# EAGLE design avrisp (EAGLE 4.16)
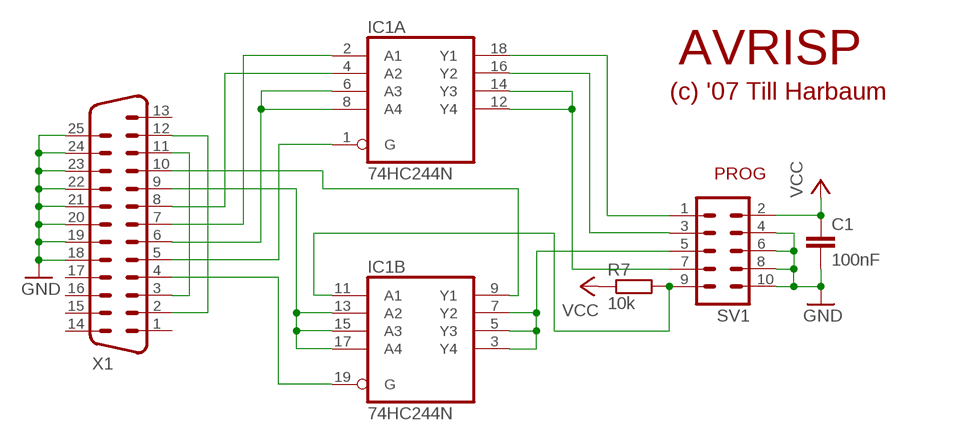
[diagram p0: schematic, sheet 1]

## Parts
C1  100nF  C-EU050-025X075  [C050-025X075]
IC1  74HC244N  [DIL20]
R7  10k  R-EU_0207/10  [0207/10]
SV1  ML10  [ML10]
X1  M25D  [M25D]

## Nets
GND: C1.2 SV1.4 SV1.6 SV1.8 SV1.10 X1.18 X1.19 X1.20 X1.21 X1.22 X1.23 X1.24 X1.25
N$1: IC1.16(A:Y2) SV1.3
N$4: IC1.3(B:Y4) IC1.5(B:Y3) IC1.7(B:Y2) SV1.5
N$5: IC1.9(B:Y1) X1.10
N$8: IC1.1(A:G) X1.5
N$9: IC1.13(B:A2) IC1.15(B:A3) IC1.17(B:A4) X1.9
N$10: X1.2 X1.12
N$11: X1.3 X1.11
N$13: IC1.4(A:A2) X1.8
N$14: IC1.18(A:Y1) SV1.1
N$15: IC1.12(A:Y4) IC1.14(A:Y3) SV1.7
N$16: IC1.11(B:A1) R7.2 SV1.9
N$17: IC1.2(A:A1) X1.7
N$18: IC1.6(A:A3) IC1.8(A:A4) X1.6
N$19: IC1.19(B:G) X1.4
VCC: C1.1 R7.1 SV1.2
Unconnected: X1.1 X1.13 X1.14 X1.15 X1.16 X1.17

## Notes on the sheet
- AVRISP
- (c) '07 Till Harbaum
- PROG

## Power pins joined to a net without a drawn wire
GND: IC1.10(P:GND)
VCC: IC1.20(P:VCC)

## Library data of the parts
C1 = rcl:C-EU: CAPACITOR, European symbol
IC1 = 74xx-eu:74*244: Octal BUFFER and LINE DRIVER, 3-state
R7 = rcl:R-EU_: RESISTOR, European symbol
SV1 = con-ml:ML10: HARTING
X1 = con-subd:M25: SUB-D

## Board
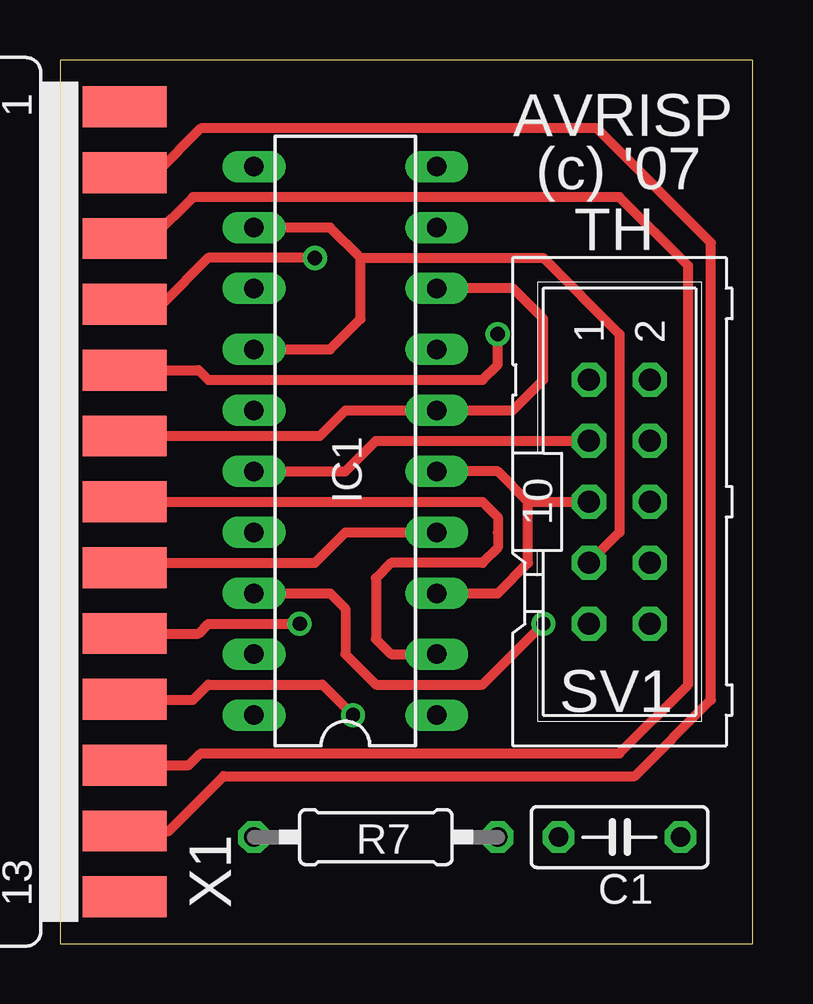
[diagram p1: board, top side]
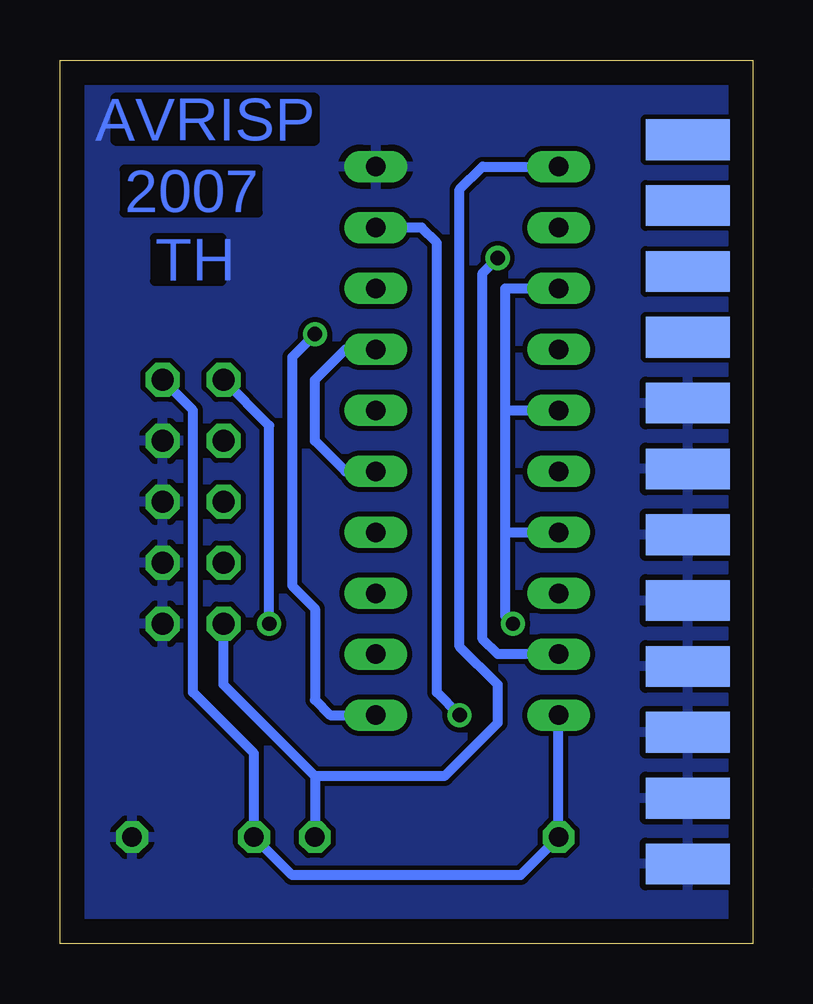
[diagram p2: board, bottom side, seen from below]

Size 28.88 x 36.82 mm. Coordinates in mm from the lower left corner, seen from the top.
Outline: 0,0 28.88,0 28.88,36.82 0,36.82 0,0
Copper layers (1*16): Top 0.035mm / dielectric 1.5mm / Bottom 0.035mm
Design rules "default": minimum track width 10mil, minimum drill 24mil, track to track 8mil, track to pad 8mil, pad to pad 8mil, via to via 8mil, smd to smd 8mil, copper to edge 40mil, drill to drill 8mil, minimum pad ring 10mil, minimum via ring 8mil, stop-mask expansion 4mil, vias tented up to drill 0mil, thermal gap 10mil

### Footprints (pad centres in the part's own frame; a part is rotated, then mirrored left to right if it is on the bottom)
C050-025X075 = drill 0.813 octagon: 1 -2.54,0; 2 2.54,0
DIL20 = drill 0.813 long: 1 -11.43,-3.81; 2 -8.89,-3.81; 3 -6.35,-3.81; 4 -3.81,-3.81; 5 -1.27,-3.81; 6 1.27,-3.81; 7 3.81,-3.81; 8 6.35,-3.81; 9 8.89,-3.81; 10 11.43,-3.81; 11 11.43,3.81; 12 8.89,3.81; 13 6.35,3.81; 14 3.81,3.81; 15 1.27,3.81; 16 -1.27,3.81; 17 -3.81,3.81; 18 -6.35,3.81; 19 -8.89,3.81; 20 -11.43,3.81
0207/10 = drill 0.813 octagon: 1 -5.08,0; 2 5.08,0
ML10 = drill 0.914 octagon: 1 -5.08,-1.27; 2 -5.08,1.27; 3 -2.54,-1.27; 4 -2.54,1.27; 5 0,-1.27; 6 0,1.27; 7 2.54,-1.27; 8 2.54,1.27; 9 5.08,-1.27; 10 5.08,1.27
M25D = smd 1.7 x 3.5: 1 16.459,-6.045; 2 13.716,-6.045; 3 10.973,-6.045; 4 8.23,-6.045; 5 5.486,-6.045; 6 2.743,-6.045; 7 0,-6.045; 8 -2.743,-6.045; 9 -5.486,-6.045; 10 -8.23,-6.045; 11 -10.973,-6.045; 12 -13.716,-6.045; 13 -16.459,-6.045 | smd 1.7 x 3.5 bottom: 14 15.088,-6.045; 15 12.344,-6.045; 16 9.601,-6.045; 17 6.858,-6.045; 18 4.115,-6.045; 19 1.372,-6.045; 20 -1.372,-6.045; 21 -4.115,-6.045; 22 -6.858,-6.045; 23 -9.601,-6.045; 24 -12.344,-6.045; 25 -15.088,-6.045

### Placement (x,y rotation side)
C1  23.33,4.44 0 top
IC1  11.9,20.95 90 top
R7  13.17,4.44 0 top
SV1  23.33,18.41 270 top
X1  -3.34,18.41 90 top

### Tracks (layer width: path | path; a pad name or v marks a point on that pad's centre or on a via)
GND
  pour Bottom: 0.15,-0.01 0.15,36.83 28.73,36.83 28.73,-0.01
N$1
  Top 0.406: IC1.16 11.9,19.68 13.17,20.95 SV1.3
N$4
  Top 0.406: IC1.5 18.25,19.68 19.52,18.41 | 19.52,18.41 SV1.5 | IC1.3 18.25,14.6 19.52,15.87 19.52,18.41
  Bottom 0.406: IC1.7 16.98,24.76 18.25,23.49 18.25,20.95 16.98,19.68 IC1.5
N$5  (via drill 0.6)
  Top 0.406: X1.10 2.73,10.16 5.55,10.16 6.18,10.79 10.95,10.79 v12.22,9.52
  Bottom 0.406: v12.22,9.52 13.17,10.47 13.17,29.2 13.81,29.84 IC1.9
N$8  (via drill 0.6)
  Top 0.406: X1.5 5.78,23.9 6.18,23.49 17.61,23.49 18.25,24.12 v18.25,25.39
  Bottom 0.406: v18.25,25.39 19.2,24.44 19.2,14.92 18.25,13.97 18.25,10.16 17.61,9.52 IC1.1
N$9  (via drill 0.6)
  Top 0.406: X1.9 5.78,12.92 6.18,13.33 v10,13.33
  Bottom 0.406: 10.31,17.14 IC1.17 | 10.31,17.14 10.31,22.22 | 10.31,22.22 10.31,27.3 IC1.13 | 10.31,22.22 IC1.15 | v10,13.33 10.31,13.65 10.31,17.14
N$10
  Top 0.406: X1.2 4.03,32.13 5.87,33.97 22.38,33.97 27.14,29.2 27.14,10.16 23.96,6.98 6.82,6.98 4.53,4.69 X1.12
N$11
  Top 0.406: X1.3 3.82,29.38 5.55,31.11 23.33,31.11 26.19,28.25 26.19,10.79 23.33,7.93 5.87,7.93 5.37,7.44 X1.11
N$13
  Top 0.406: X1.8 2.91,15.87 10.63,15.87 11.9,17.14 IC1.4
N$14  (via drill 0.6)
  Top 0.406: IC1.18 11.27,14.6 11.9,13.97 11.9,12.06 13.17,10.79 17.61,10.79 v20.15,13.33
  Bottom 0.406: v20.15,13.33 20.15,21.58 SV1.1
N$15
  Top 0.406: IC1.12 11.27,29.84 12.54,28.57 | 12.54,28.57 12.54,26.03 11.27,24.76 IC1.14 | SV1.7 23.33,17.14 23.33,25.39 20.15,28.57 12.54,28.57
N$16
  Bottom 0.406: IC1.11 11.27,32.38 12.22,31.43 12.22,12.38 10.63,10.79 10.63,9.2 12.85,6.98 18.25,6.98 | SV1.9 22.06,10.79 18.25,6.98 | 18.25,6.98 R7.2
N$17
  Top 0.406: X1.7 17.61,18.41 18.25,17.77 18.25,17.14 18.25,16.5 17.61,15.87 13.81,15.87 13.17,15.24 13.17,12.7 13.81,12.06 IC1.2
N$18
  Top 0.406: X1.6 10.83,21.15 11.9,22.22 IC1.6 18.88,22.22 20.15,23.49 20.15,26.03 18.88,27.3 IC1.8
N$19  (via drill 0.6)
  Top 0.406: X1.4 2.99,26.64 3.01,26.66 4.28,26.66 6.18,28.57 v10.63,28.57
  Bottom 0.406: IC1.19 10.63,12.06 11.27,12.7 11.27,27.93 v10.63,28.57
VCC
  Bottom 0.406: IC1.20 R7.1 9.68,2.85 19.2,2.85 C1.1 20.79,7.93 23.33,10.47 23.33,22.22 SV1.2

### Text on the board
Bottom: AVRISP | 2007 | TH
tNames: AVRISP | (c) '07 | TH